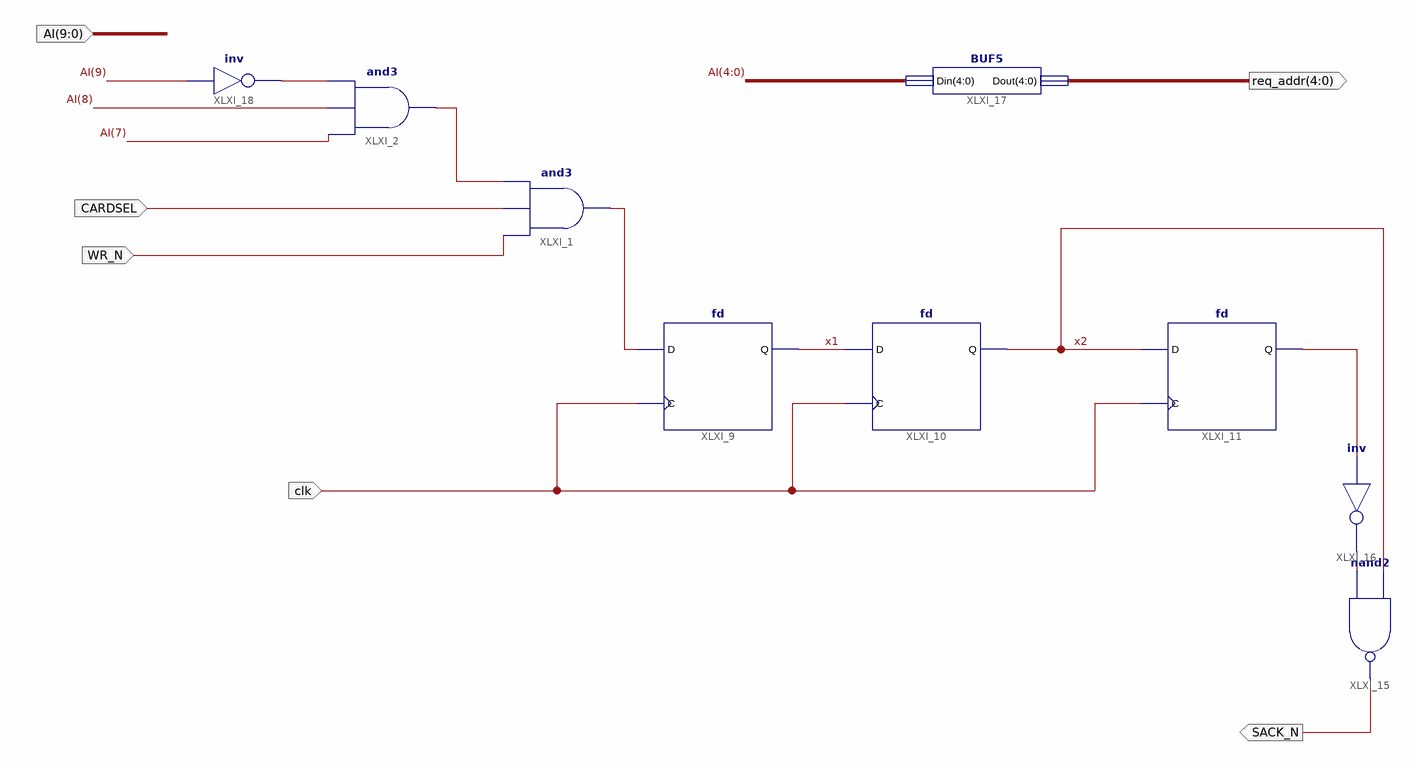
[diagram p0: schematic sheet 1]
// Xilinx ISE schematic Slave_control.sch (spartan6) as structural Verilog: 9 symbols, 6 ports
module Slave_control (
  input  CARDSEL,
  input  WR_N,
  input  [9:0] AI,
  input  clk,
  output SACK_N,
  output [4:0] req_addr
);

  wire x1, x2, XLXN_32, XLXN_66, XLXN_72, XLXN_73, XLXN_76;

  and XLXI_2 (XLXN_32, AI[7], AI[8], XLXN_76);
  and XLXI_1 (XLXN_66, WR_N, CARDSEL, XLXN_32);
  fd XLXI_10 (.C(clk), .D(x1), .Q(x2));
  fd XLXI_11 (.C(clk), .D(x2), .Q(XLXN_72));
  fd XLXI_9 (.C(clk), .D(XLXN_66), .Q(x1));
  nand XLXI_15 (SACK_N, XLXN_73, x2);
  not XLXI_16 (XLXN_73, XLXN_72);
  BUF5 XLXI_17 (.Din(AI[4:0]), .Dout(req_addr));
  not XLXI_18 (XLXN_76, AI[9]);
endmodule
